# Altium schematic sheet uMultimeter_ExpBreadBoard_Sch.SchDoc: uMultimeter_ExpBreadBoard
size 127 x 127 mm; Author: Hom; CompanyName: KitSprout; DrawnBy: Hom; Engineer: Hom; Organization: KitSprout; Revision: A; SheetNumber: 1; SheetTotal: 1; License: CC BY-SA 4.0; Version: 2.0; LibVersion: 2.0; PageSetup: Record=PageOptions|CenterHorizontal=True|CenterVertical=True|PrintScale=1.00|XCorrection=1.00|YCorrection=1.00|PrintKind=0|BorderSize=5000000|LeftOffset=0|BottomOffset=0|Orientation=2|PaperLength=1000|PaperWidth=1000|Scale=100|PaperSource=7|PrintQuality=-3|MediaType=1|DitherType=10|PrintScaleMode=0|PaperKind=A4|PaperIndex=9
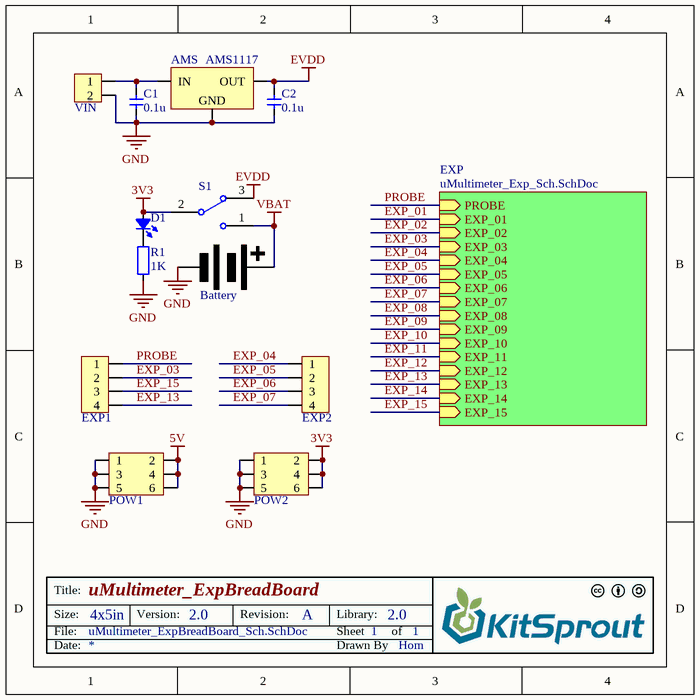
[diagram p0: uMultimeter_ExpBreadBoard_Sch.SchDoc]

## Parts
AMS  AMS1117  [SOT223-3]
Battery  Battery  [CR2032-1]  (value not drawn)
C1  value 0.1u  [CAP_0603]  (hidden comment: Cap_0603)
C2  value 0.1u  [CAP_0603]  (hidden comment: Cap_0603)
D1  LED_0805  [LED_0805_BLUE]  (value not drawn)
EXP1  HDR1x4_2.54  [HDR1x4_2.54_180]  (value not drawn)
EXP2  HDR1x4_2.54  [HDR1x4_2.54_180]  (value not drawn)
POW1  HDR2x3_2.54  [HDR2X3_2.54_180]  (value not drawn)
POW2  HDR2x3_2.54  [HDR2X3_2.54_180]  (value not drawn)
R1  value 1K  [RES_0603]  (hidden comment: Res_0603)
S1  SwitchSPDT_2.8x6.6_90  [SwitchSPDT_2.8X6.6_90]  (value not drawn)
VIN  HDR1x2_2.54  [HDR1X2_2.54_90]  (value not drawn)

## Sub-sheets
EXP = uMultimeter_Exp_Sch.SchDoc: PROBE (in), EXP_01 (in), EXP_02 (in), EXP_03 (in), EXP_04 (in), EXP_05 (in), EXP_06 (in), EXP_07 (in), EXP_08 (in), EXP_09 (in), EXP_10 (in), EXP_11 (in), EXP_12 (in), EXP_13 (in), EXP_14 (in), EXP_15 (in)

## Nets
3V3: D1.1(A) POW2.2 POW2.4 POW2.6 S1.2
5V: POW1.2 POW1.4 POW1.6
EVDD: AMS.2(OUT) C2.2 S1.3
GND: AMS.1(GND) Battery.1(-) C1.1 C2.1 POW1.1 POW1.3 POW1.5 POW2.1 POW2.3 POW2.5 R1.2 VIN.2
VBAT: Battery.2(+) S1.1
EXP_01: sheet EXP/EXP_01
EXP_02: sheet EXP/EXP_02
EXP_03: EXP1.2 ; sheet EXP/EXP_03
EXP_04: EXP2.1 ; sheet EXP/EXP_04
EXP_05: EXP2.2 ; sheet EXP/EXP_05
EXP_06: EXP2.3 ; sheet EXP/EXP_06
EXP_07: EXP2.4 ; sheet EXP/EXP_07
EXP_08: sheet EXP/EXP_08
EXP_09: sheet EXP/EXP_09
EXP_10: sheet EXP/EXP_10
EXP_11: sheet EXP/EXP_11
EXP_12: sheet EXP/EXP_12
EXP_13: EXP1.4 ; sheet EXP/EXP_13
EXP_14: sheet EXP/EXP_14
EXP_15: EXP1.3 ; sheet EXP/EXP_15
PROBE: EXP1.1 ; sheet EXP/PROBE
NetAMS_3: AMS.3(IN) C1.2 VIN.1
NetD1_2: D1.2(K) R1.1

## Notes on the sheet
- Title:
- Size:
- Date:
- File:
- 4x5in
- Version:
- Revision:
- Sheet
- Drawn By
- Library:
- of

## Library data of the parts
AMS = AMS1117: Power
C1 C2 = Cap_0603: Capacitor
D1 = LED_0805: LED
EXP1 = HDR1x4_2.54T: Header
EXP2 = HDR1x4_2.54: Header
POW1 POW2 = HDR2x3_2.54: Header
R1 = Res_0603: Resistor
S1 = SwitchSPDT_2.8x6.6_90: Switch
VIN = HDR1x2_2.54T: Header